# EAGLE design Board (EAGLE 8.3.0)
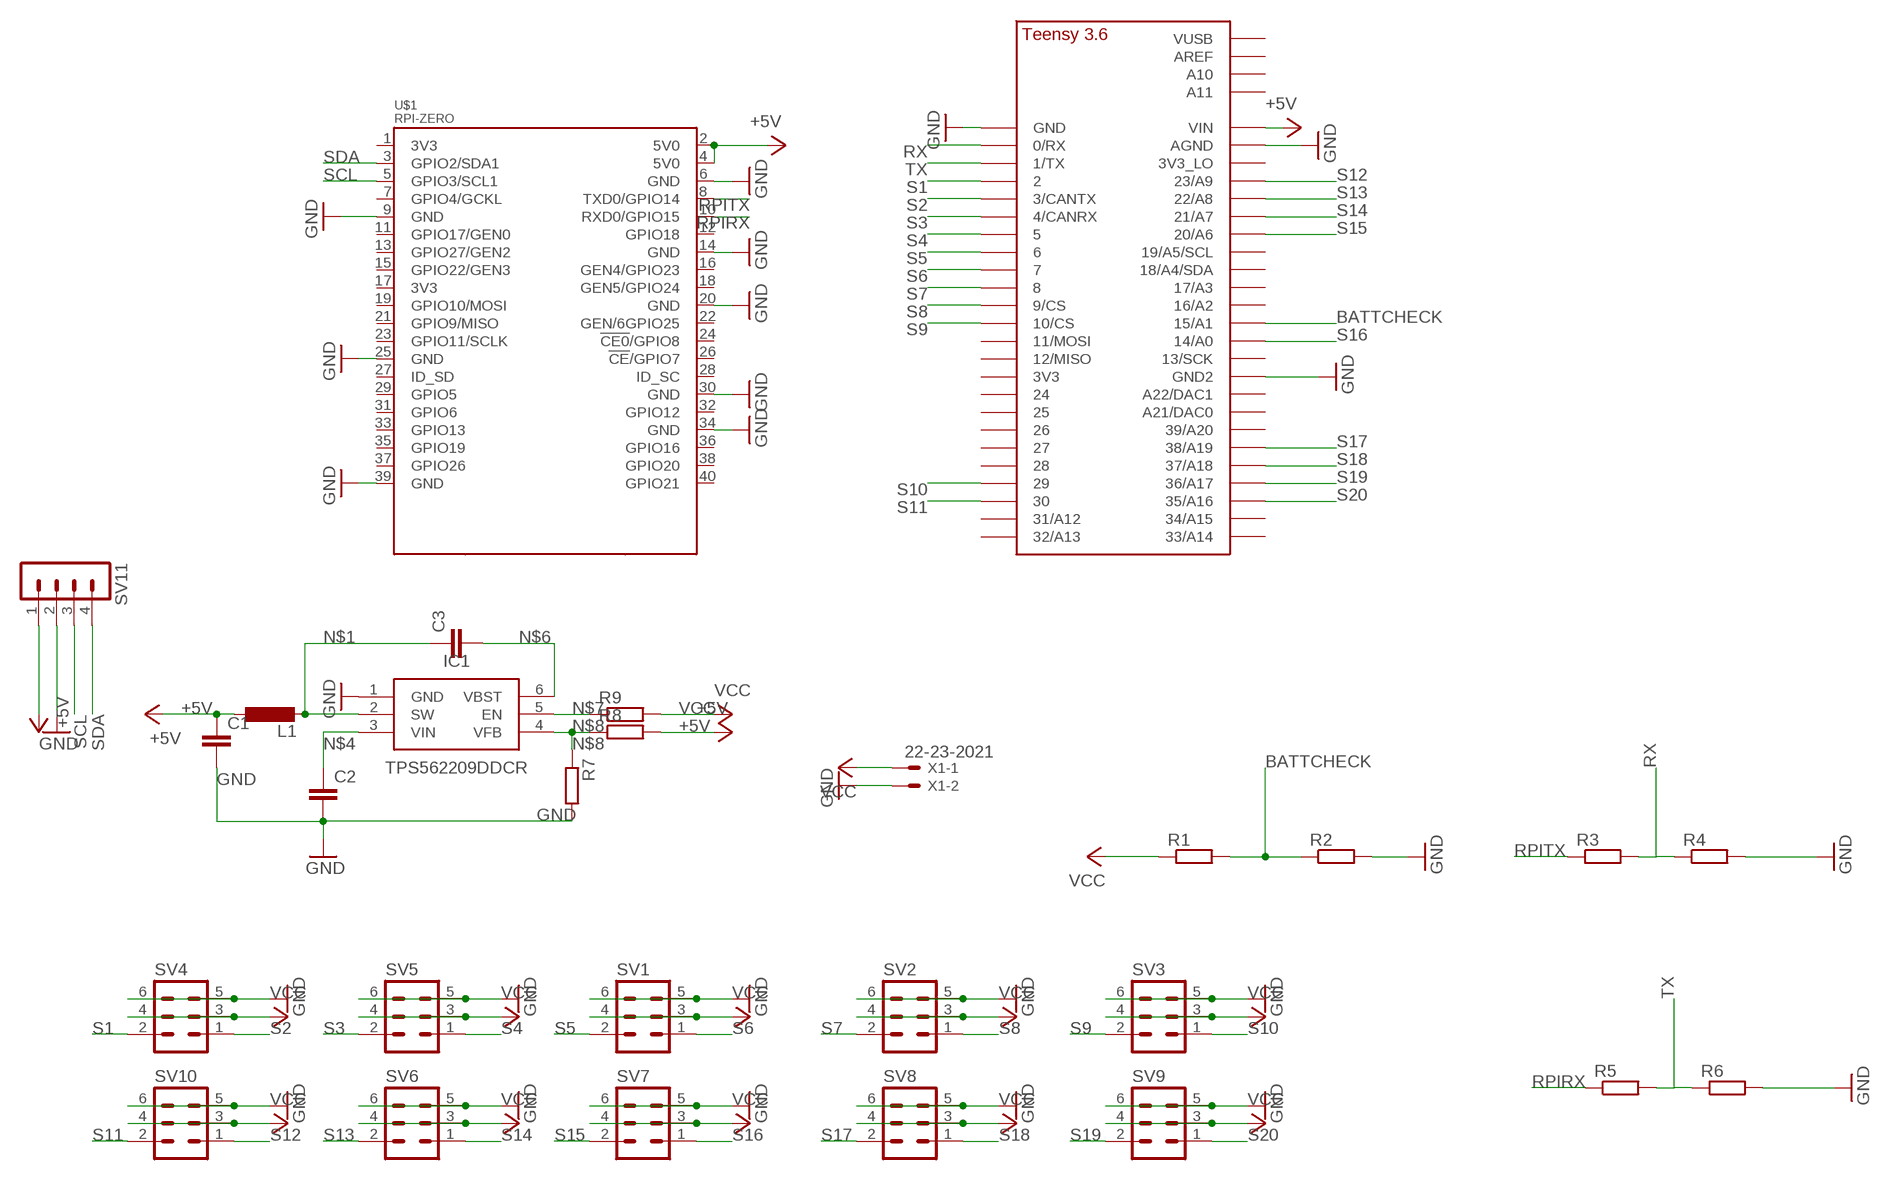
[diagram p0: schematic, sheet 1]

## Parts
C1  C-EUC0402  [C0402]
C2  C-EUC0402  [C0402]
C3  C-EUC0201  [C0201]
IC1  TPS562209DDCR  [SOT95P280X110-6N]
L1  L-EUL2012C  [L2012C]
R1  R-EU_R0201  [R0201]
R2  R-EU_R0201  [R0201]
R3  R-EU_R0201  [R0201]
R4  R-EU_R0201  [R0201]
R5  R-EU_R0201  [R0201]
R6  R-EU_R0201  [R0201]
R7  R-EU_R0201  [R0201]
R8  R-EU_R0201  [R0201]
R9  R-EU_R0201  [R0201]
SV1  MA03-2  [MA03-2]
SV2  MA03-2  [MA03-2]
SV3  MA03-2  [MA03-2]
SV4  MA03-2  [MA03-2]
SV5  MA03-2  [MA03-2]
SV6  MA03-2  [MA03-2]
SV7  MA03-2  [MA03-2]
SV8  MA03-2  [MA03-2]
SV9  MA03-2  [MA03-2]
SV10  MA03-2  [MA03-2]
SV11  MA04-1  [MA04-1]
U$1  RPI-ZERO  [RASPBERRYPI_BASTELSTUBE_V13_RASPI_BOARD_B+_FULL]
U$2  TEENSY_3.5/3.6_BASIC  [TEENSY_3.5/3.6_BASIC]
X1  22-23-2021  [22-23-2021]

## Nets
+5V: C1.1 L1.1 R8.2 SV11.1 U$1.2(5V0) U$1.4(5V0) U$2.VIN
BATTCHECK: R1.2 R2.1 U$2.15/A1
GND: C1.2 C2.2 IC1.1(GND) R2.2 R4.2 R6.2 R7.2 SV1.5 SV1.6 SV2.5 SV2.6 SV3.5 SV3.6 SV4.5 SV4.6 SV5.5 SV5.6 SV6.5 SV6.6 SV7.5 SV7.6 SV8.5 SV8.6 SV9.5 SV9.6 SV10.5 SV10.6 SV11.2 U$1.6(GND) U$1.9(GND) U$1.14(GND) U$1.20(GND) U$1.25(GND) U$1.30(GND) U$1.34(GND) U$1.39(GND) U$2.AGND U$2.GND U$2.GND2 X1.2
N$1: C3.1 IC1.2(SW) L1.2
N$4: C2.1 IC1.3(VIN)
N$6: C3.2 IC1.6(VBST)
N$7: IC1.5(EN) R9.1
N$8: IC1.4(VFB) R7.1 R8.1
RPIRX: R5.1 U$1.10(RXD0/GPIO15)
RPITX: R3.1 U$1.8(TXD0/GPIO14)
RX: R3.2 R4.1 U$2.0/RX
S1: SV4.2 U$2.2
S2: SV4.1 U$2.3/CANTX
S3: SV5.2 U$2.4/CANRX
S4: SV5.1 U$2.5
S5: SV1.2 U$2.6
S6: SV1.1 U$2.7
S7: SV2.2 U$2.8
S8: SV2.1 U$2.9/CS
S9: SV3.2 U$2.10/CS
S10: SV3.1 U$2.29
S11: SV10.2 U$2.30
S12: SV10.1 U$2.23/A9
S13: SV6.2 U$2.22/A8
S14: SV6.1 U$2.21/A7
S15: SV7.2 U$2.20/A6
S16: SV7.1 U$2.14/A0
S17: SV8.2 U$2.38/A19
S18: SV8.1 U$2.37/A18
S19: SV9.2 U$2.36/A17
S20: SV9.1 U$2.35/A16
SCL: SV11.3 U$1.5(GPIO3/SCL1)
SDA: SV11.4 U$1.3(GPIO2/SDA1)
TX: R5.2 R6.1 U$2.1/TX
VCC: R1.1 R9.2 SV1.3 SV1.4 SV2.3 SV2.4 SV3.3 SV3.4 SV4.3 SV4.4 SV5.3 SV5.4 SV6.3 SV6.4 SV7.3 SV7.4 SV8.3 SV8.4 SV9.3 SV9.4 SV10.3 SV10.4 X1.1
Unconnected: U$1.1(3V3) U$1.7(GPIO4/GCKL) U$1.11(GPIO17/GEN0) U$1.12(GPIO18) U$1.13(GPIO27/GEN2) U$1.15(GPIO22/GEN3) U$1.16(GEN4/GPIO23) U$1.17(3V3) U$1.18(GEN5/GPIO24) U$1.19(GPIO10/MOSI) U$1.21(GPIO9/MISO) U$1.22(GEN/6GPIO25) U$1.23(GPIO11/SCLK) U$1.24(!CE0!/GPIO8) U$1.26(!CE!/GPIO7) U$1.27(ID_SD) U$1.28(ID_SC) U$1.29(GPIO5) U$1.31(GPIO6) U$1.32(GPIO12) U$1.33(GPIO13) U$1.35(GPIO19) U$1.36(GPIO16) U$1.37(GPIO26) U$1.38(GPIO20) U$1.40(GPIO21) U$2.3V3 U$2.3V3_LO U$2.11/MOSI U$2.12/MISO U$2.13/SCK U$2.16/A2 U$2.17/A3 U$2.18/A4/SDA U$2.19/A5/SCL U$2.21/DAC0(A21/DAC0) U$2.24 U$2.25 U$2.26 U$2.27 U$2.28 U$2.31/A12 U$2.32/A13 U$2.33/A14 U$2.34/A15 U$2.39/A20 U$2.A10 U$2.A11 U$2.A22/DAC1 U$2.AREF U$2.VUSB

## Library data of the parts
C1-C3 = resistor:C-EU: CAPACITOR, European symbol
IC1 = TPS562209DDCR:TPS562209DDCR: 17 V Input, 2A Synchronous Step-Down Regulator in SOT-23 <https://componentsearchengine.com/Images/9/TPS562209DDCR.jpg> Source: Datasheet <http://www.ti.com/lit/gpn/tps562209>; DESCRIPTION: 17 V Input, 2A Synchronous Step-Down Regulator in SOT-23; HEIGHT: 1.1mm; MANUFACTURER_NAME: Texas Instruments; MANUFACTURER_PART_NUMBER: TPS562209DDCR; SUPPLIER_NAME: RS
L1 = resistor:L-EU: INDUCTOR, European symbol
R1-R9 = resistor:R-EU_: RESISTOR, European symbol
SV1-SV10 = con-lstb:MA03-2: PIN HEADER; OC_FARNELL: unknown; OC_NEWARK: unknown
SV11 = con-lstb:MA04-1: PIN HEADER; OC_FARNELL: unknown; OC_NEWARK: unknown
U$1 = RPI-Zero:RPI-ZERO
U$2 = Teensy356:TEENSY_3.5/3.6_BASIC
X1 = con-molex:22-23-2021: .100" (2.54mm) Center Header - 2 Pin; MF: MOLEX; MPN: 22-23-2021; OC_FARNELL: 1462926; OC_NEWARK: 25C3832

## Board
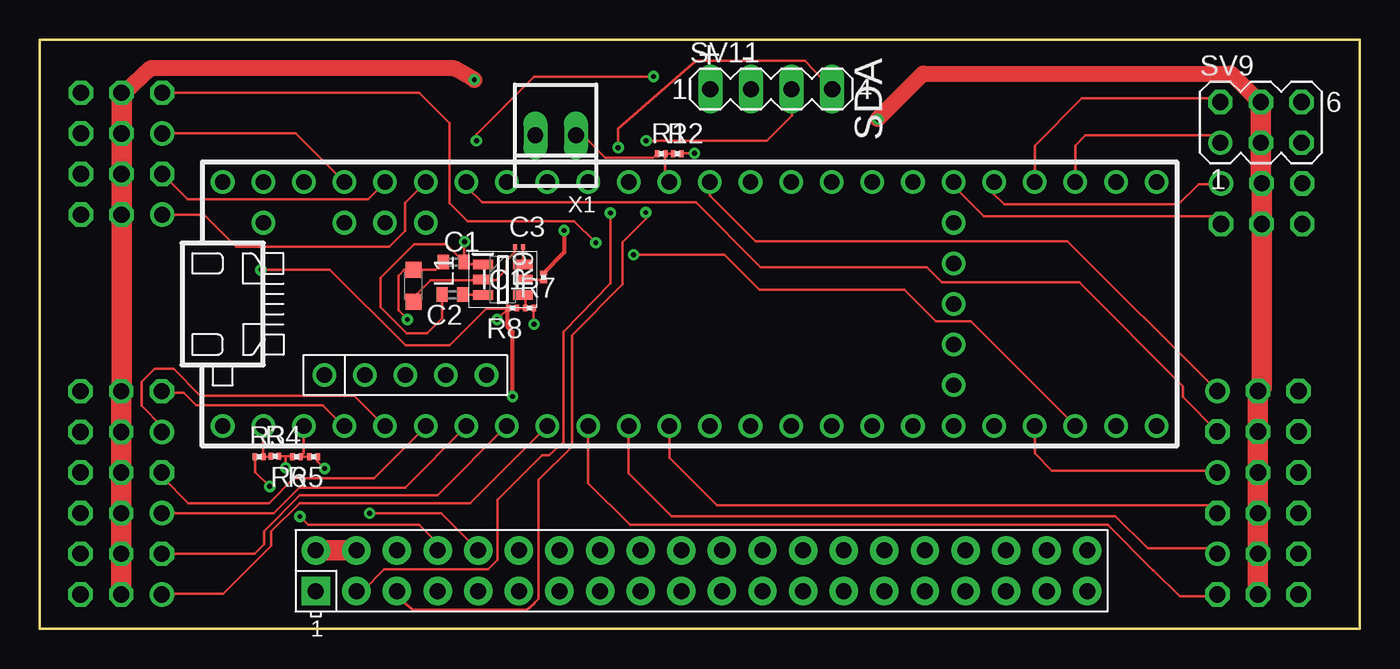
[diagram p1: board, top side]
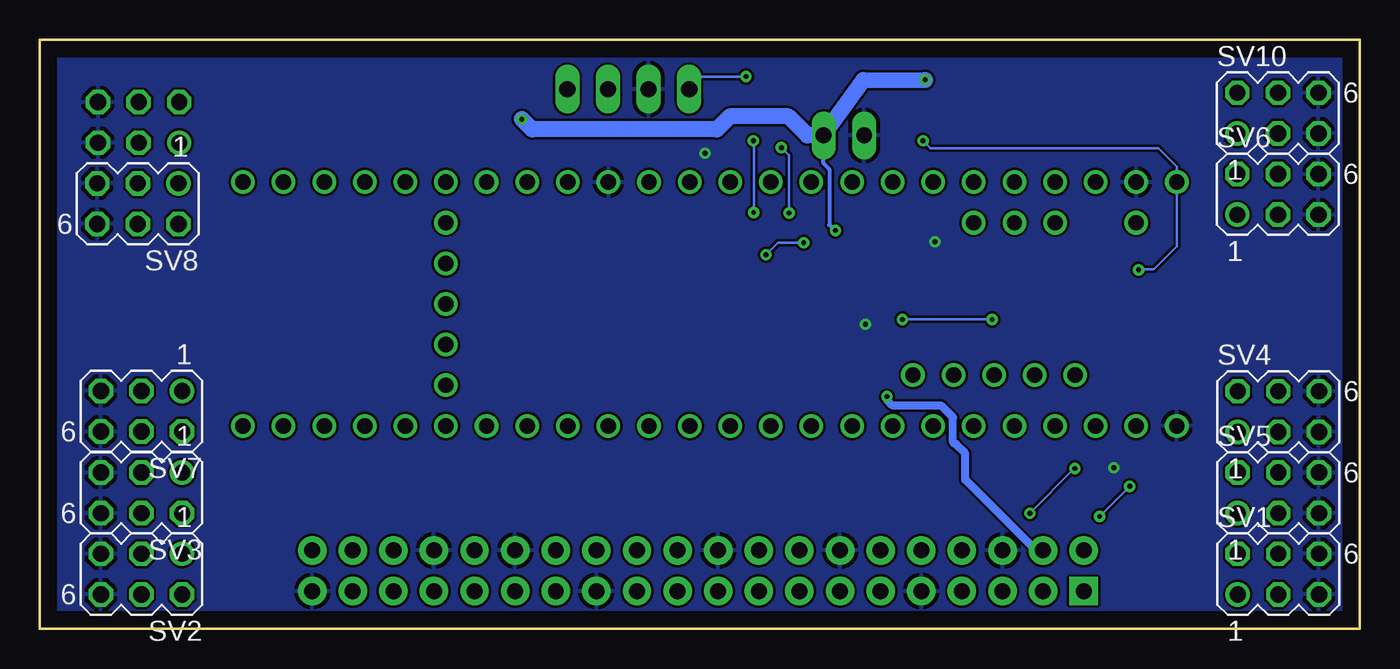
[diagram p2: board, bottom side, seen from below]

Size 82.55 x 36.83 mm. Coordinates in mm from the lower left corner, seen from the top.
Outline: 0,36.83 0,0 82.55,0 82.55,36.83 0,36.83
Copper layers (1*16): Top 0.035mm / dielectric 1.5mm / Bottom 0.035mm
Design rules "default *": minimum track width 6mil, minimum drill 0.3mm, track to track 6mil, track to pad 6mil, pad to pad 6mil, via to via 12mil, smd to smd 6mil, copper to edge 40mil, drill to drill 12mil, minimum pad ring 10mil, minimum via ring 8mil, stop-mask expansion 4mil, vias tented up to drill 0mil, thermal gap 10mil

### Footprints (pad centres in the part's own frame; a part is rotated, then mirrored left to right if it is on the bottom)
C0402 = smd 0.7 x 0.9: 1 -0.65,0; 2 0.65,0
C0201 = smd 0.25 x 0.35: 1 -0.25,0; 2 0.25,0
SOT95P280X110-6N = smd 1.25 x 0.6: 1 -1.25,0.95; 2 -1.25,0; 3 -1.25,-0.95; 4 1.25,-0.95; 5 1.25,0; 6 1.25,0.95
L2012C = smd 1 x 1: 1 -1,0; 2 1,0
R0201 = smd 0.28 x 0.43: 1 -0.255,0; 2 0.255,0
MA03-2 = drill 1.016: 1 -2.54,-1.27 | drill 1.016 octagon: 2 -2.54,1.27; 3 0,-1.27; 4 0,1.27; 5 2.54,-1.27; 6 2.54,1.27
MA04-1 = drill 1.016 long: 1 -3.81,0; 2 -1.27,0; 3 1.27,0; 4 3.81,0
RASPBERRYPI_BASTELSTUBE_V13_RASPI_BOARD_B+_FULL = drill 1 pad 1.778 square: 1 8.37,25.23 | drill 1 pad 1.778: 2 8.37,27.77; 3 10.91,25.23; 4 10.91,27.77; 5 13.45,25.23; 6 13.45,27.77; 7 15.99,25.23; 8 15.99,27.77; 9 18.53,25.23; 10 18.53,27.77; 11 21.07,25.23; 12 21.07,27.77; 13 23.61,25.23; 14 23.61,27.77; 15 26.15,25.23; 16 26.15,27.77; 17 28.69,25.23; 18 28.69,27.77; 19 31.23,25.23; 20 31.23,27.77; 21 33.77,25.23; 22 33.77,27.77; 23 36.31,25.23; 24 36.31,27.77; 25 38.85,25.23; 26 38.85,27.77; 27 41.39,25.23; 28 41.39,27.77; 29 43.93,25.23; 30 43.93,27.77; 31 46.47,25.23; 32 46.47,27.77; 33 49.01,25.23; 34 49.01,27.77; 35 51.55,25.23; 36 51.55,27.77; 37 54.09,25.23; 38 54.09,27.77; 39 56.63,25.23; 40 56.63,27.77
TEENSY_3.5/3.6 = drill 0.965: 0/RX -25.4,-7.62; 1/TX -22.86,-7.62; 2 -20.32,-7.62; 3/CANTX -17.78,-7.62; 3V3 7.62,-7.62; 3V3_2 17.78,-2.54; 3V3_LO -22.86,7.62; 4/CANRX -15.24,-7.62; 5 -12.7,-7.62; 6 -10.16,-7.62; 7 -7.62,-7.62; 8 -5.08,-7.62; 9/CS -2.54,-7.62; 10/CS 0,-7.62; 11/MOSI 2.54,-7.62; 12/MISO 5.08,-7.62; 13/SCK 5.08,7.62; 14/A0 2.54,7.62; 15/A1 0,7.62; 16/A2 -2.54,7.62; 17/A3 -5.08,7.62; 18/A4/SDA -7.62,7.62; 19/A5/SCL -10.16,7.62; 20/A6 -12.7,7.62; 21/A7 -15.24,7.62; 21/DAC0 12.7,7.62; 22/A8 -17.78,7.62; 23/A9 -20.32,7.62; 24 10.16,-7.62; 25 12.7,-7.62; 26 15.24,-7.62; 27 17.78,-7.62; 28 20.32,-7.62; 29 22.86,-7.62; 30 25.4,-7.62; 31/A12 27.94,-7.62; 32/A13 30.48,-7.62; 33/A14 30.48,7.62; 34/A15 27.94,7.62; 35/A16 25.4,7.62; 36/A17 22.86,7.62; 37/A18 20.32,7.62; 38/A19 17.78,7.62; 39/A20 15.24,7.62; A10 -17.78,5.08; A11 -15.24,5.08; A22/DAC1 10.16,7.62; AGND -25.4,7.62; AREF -20.32,5.08; GND -27.94,-7.62; GND2 7.62,7.62; GND3 17.78,0; PROG 17.78,2.54; RESET 17.78,5.08; U5V -21.59,-4.445; UD+ -16.51,-4.445; UD- -19.05,-4.445; UGND1 -13.97,-4.445; UGND2 -11.43,-4.445; VBAT 17.78,-5.08; VIN -27.94,7.62; VUSB -25.4,5.08
22-23-2021 = drill 1 long: 1 -1.27,0; 2 1.27,0

### Placement (x,y rotation side)
C1  25.88,22.94 0 top
C2  25.81,20.9 180 top
C3  29.97,23.88 0 top
IC1  28.96,21.84 0 top
L1  23.37,21.46 270 top
R1  38.86,29.72 0 top
R2  39.88,29.72 0 top
R3  13.72,10.77 0 top
R4  14.71,10.79 0 top
R5  17.12,10.77 180 top
R6  16.05,10.77 180 top
R7  30.63,20.07 0 top
R8  29.57,20.07 180 top
R9  31.5,22 90 top
SV1  5.08,3.43 0 bottom
SV2  76.2,3.43 180 bottom
SV3  76.2,8.51 180 bottom
SV4  5.08,13.59 0 bottom
SV5  5.08,8.51 0 bottom
SV6  5.11,27.18 0 bottom
SV7  76.2,13.61 180 bottom
SV8  76.43,26.59 180 bottom
SV9  76.38,31.67 0 top
SV10  5.11,32.26 0 bottom
SV11  45.75,33.76 0 top
U$1  8.89,-22.86 0 top
U$2  TEENSY_3.5/3.6  [TEENSY_3.5/3.6]  39.37,20.32 0 top
X1  32.26,30.86 180 top

### Tracks (layer width: path | path; a pad name or v marks a point on that pad's centre or on a via)
+5V  (via drill 0.3 pad 0.55)
  Top 0.152: C1.1 24.76,22.46 L1.1 22.79,22.46 22.43,22.1 22.43,19.91 v22.99,19.36 | v28.6,19.36 R8.2 29.26,20.02 27.91,20.02 25.63,17.73 22.86,17.73 18.14,22.45 v13.82,22.45 | v27.3,30.53 27.3,30.94 30.91,34.54 v38.38,34.54
  Top 0.254: v29.57,14.53 29.57,18.57 29.26,18.87 29.26,20.02 R8.2
  Top 1.27: U$1.2 U$1.4
  Bottom 0.152: v22.99,19.36 v28.6,19.36 | v13.82,22.45 13.79,22.48 12.88,22.48 11.43,23.93 U$2.VIN 11.43,28.91 12.6,30.07 26.85,30.07 v27.3,30.53 | v38.38,34.54 41.15,34.54 SV11.1
  Bottom 0.508: U$1.4 20.25,4.91 24.66,9.32 24.66,10.97 25.25,11.56 25.3,11.56 25.43,11.68 25.43,13.23 26.16,13.97 29.21,13.97 29.54,14.3 29.54,14.5 v29.57,14.53
BATTCHECK
  Top 0.152: R2.1 R1.2 39.12,28.19 U$2.15/A1
GND  (via drill 0.3 pad 0.55)
  Top 0.152: 15.37,10.79 R4.2 | 15.37,10.79 v15.37,10.08 | IC1.1 26.68,22.79 C1.2 | C2.2 25.16,19.42 24.23,18.49 22.94,18.49 21.31,20.12 21.31,21.95 23.42,24.05 25.41,24.05 C1.2 | C1.2 26.53,24.17 v26.57,24.21 | R7.2 30.89,19.07 v30.91,19.05 | R2.2 40.16,29.74 v40.95,29.74 | R6.2 15.77,10.79 15.37,10.79
  pour Bottom: 0,0 0,36.83 82.55,36.83 82.55,0
N$1
  Top 0.152: C3.1 29.7,23.55 29.18,23.04 29.18,22.5 28.5,21.79 27.76,21.79 27.73,21.82 | 27.73,21.82 IC1.2 | L1.2 23.37,20.75 24.43,21.82 27.73,21.82
N$4
  Top 0.152: IC1.3 C2.1
N$6
  Top 0.152: C3.2 30.22,22.81 IC1.6
N$7
  Top 0.152: IC1.5 31.39,21.84 R9.1
N$8
  Top 0.152: R8.1 R7.1 30.38,20.72 IC1.4
RPIRX  (via drill 0.3 pad 0.55)
  Top 0.152: R5.1 17.38,10.46 v17.8,10.03 | v20.62,7.24 25.09,7.24 U$1.10
  Bottom 0.152: v17.8,10.03 17.83,10.03 v20.62,7.24
RPITX  (via drill 0.3 pad 0.55)
  Top 0.152: R3.1 13.46,9.8 v14.38,8.91 | U$1.8 24.87,4.9 24.87,5.36 23.72,6.5 16.76,6.5 16.26,7.01 v16.26,7.04
  Bottom 0.152: v14.38,8.91 v16.26,7.04
RX
  Top 0.152: U$2.0/RX R3.2 14.43,10.77 R4.1
S1
  Top 0.152: SV4.2 7.62,14.78 8.99,14.78 9.78,13.99 17.68,13.99 18.97,12.7 U$2.2
S2
  Top 0.152: U$2.3/CANTX 21.57,12.68 19.66,14.58 10.03,14.58 8.36,16.26 7.16,16.26 6.35,15.44 6.35,13.95 7.64,12.65 7.64,12.32 SV4.1
S3
  Top 0.152: U$2.4/CANRX 24.18,12.7 20.9,9.42 15.88,9.42 14.33,7.87 9.27,7.87 7.67,9.47 7.67,9.8 7.64,9.8 SV5.2
S4
  Top 0.152: U$2.5 26.7,12.7 22.84,8.84 16.2,8.84 14.61,7.24 SV5.1
S5
  Top 0.152: SV1.2 13.44,4.7 14.02,5.28 14.02,6.12 16.26,8.36 24.87,8.36 29.23,12.72 U$2.6
S6
  Top 0.152: U$2.7 26.9,7.85 16.23,7.85 14.48,6.1 14.48,5.21 11.46,2.18 7.64,2.18 SV1.1
S7
  Top 0.152: U$2.8 34.29,9.12 36.91,6.5 66.8,6.5 69.62,3.68 69.65,3.68 71.3,2.03 73.53,2.03 SV2.2
S8
  Top 0.152: U$2.9/CS 36.83,9.73 39.5,7.06 67.28,7.06 69.32,5.03 73.33,5.03 SV2.1
S9
  Top 0.152: U$2.10/CS 39.37,10.72 42.37,7.72 73.18,7.72 SV3.2
S10
  Top 0.152: U$2.29 62.23,10.97 63.3,9.91 73.53,9.91 SV3.1
S11  (via drill 0.3 pad 0.55)
  Top 0.152: SV10.2 23.72,33.53 25.63,31.62 25.63,26.62 26.75,25.5 33.43,25.5 v34.77,24.16 | v37.13,23.39 42.82,23.39 45.01,21.21 54.08,21.21 56.06,19.23 58.24,19.23 U$2.30
  Bottom 0.152: v34.77,24.16 36.37,24.16 v37.13,23.39 | v37.13,23.39 37.16,23.37 v37.13,23.39
S12
  Top 0.152: SV10.1 16,30.99 U$2.23/A9
S13
  Top 0.152: SV6.2 7.67,28.45 9.25,26.87 20.52,26.87 U$2.22/A8
S14
  Top 0.152: SV6.1 10.26,25.91 12.27,23.9 21.84,23.9 22.84,24.89 22.84,26.64 U$2.21/A7
S15
  Top 0.152: U$2.20/A6 26.67,27.66 27.66,26.67 41.05,26.67 45.09,22.63 55.47,22.63 56.44,21.67 65.02,21.67 71.5,15.19 71.5,14.5 SV7.2
S16
  Top 0.152: U$2.14/A0 41.91,27.1 44.76,24.26 64.29,24.26 SV7.1
S17
  Top 0.152: U$2.38/A19 57.15,27.71 59.05,25.81 73.41,25.81 SV8.2
S18
  Top 0.152: U$2.37/A18 59.69,27.18 60.33,26.54 71.22,26.54 72.49,27.81 73.84,27.81 SV8.1
S19
  Top 0.152: U$2.36/A17 62.23,30.23 65.18,33.17 73.61,33.17 SV9.2
S20
  Top 0.152: U$2.35/A16 64.77,30.23 65.41,30.86 73.38,30.86 SV9.1
SCL  (via drill 0.3 pad 0.55)
  Top 0.152: U$1.5 22.34,2.02 23.29,1.22 30.48,1.19 30.94,1.6 30.94,1.63 31.19,1.88 31.19,9.32 33.27,11.4 33.27,18.36 36.45,21.54 36.45,24.18 37.92,25.65 37.92,26.01 v37.9,26.04 | v37.92,30.53 45.49,30.53 47.04,32.08 47.07,33.71 SV11.3
  Bottom 0.152: v37.9,26.04 37.9,30.45 37.92,30.48 v37.92,30.53
SDA  (via drill 0.3 pad 0.55)
  Top 0.152: U$1.3 20.18,2.37 21.54,3.73 28.04,3.73 28.63,4.32 28.63,8.08 31.42,10.87 31.85,10.87 32.77,11.68 32.77,18.59 35.69,21.61 35.69,25.93 35.71,25.96 v35.69,26.01 | v36.17,30.1 36.17,31.27 41.05,35.53 47.85,35.53 SV11.4
  Bottom 0.152: v35.69,26.01 35.69,29.62 v36.17,30.1
TX
  Top 0.152: U$2.1/TX 16.51,10.97 R6.1 R5.2
VCC  (via drill 0.3 pad 0.55)
  Top 0.152: X1.1 33.96,30.86 35.36,29.46 38.35,29.46 R1.1
  Top 0.254: v32.79,24.92 32.79,23.55 R9.2
  Top 1.016: v52.4,31.88 55.24,34.72 74.52,34.72 76.3,32.94 SV9.4 | v27.18,34.34 25.93,35.05 6.91,35.05 5.26,33.53 SV10.4
  Top 1.27: SV10.4 SV10.3 SV6.4 SV6.3 5.11,14.88 SV4.4 SV4.3 SV5.4 SV5.3 SV1.4 SV1.3 | SV9.4 SV9.3 76.38,27.91 SV8.3 SV8.4 76.43,15.11 SV7.3 SV7.4 SV3.3 SV3.4 SV2.3 SV2.4
  Bottom 0.254: X1.1 33.53,29.11 33.22,28.8 33.22,28.78 33.17,28.73 33.17,25.27 32.82,24.92 v32.79,24.92
  Bottom 1.016: v52.4,31.88 51.77,31.24 40.21,31.24 39.4,32.05 35.74,32.05 34.54,30.86 X1.1 31.04,34.31 v27.18,34.34

### Text on the board
tSilk: SDA | + | -